# EAGLE schematic LSU 4.9 OpenAFR MainBoard (EAGLE 9.6.2)
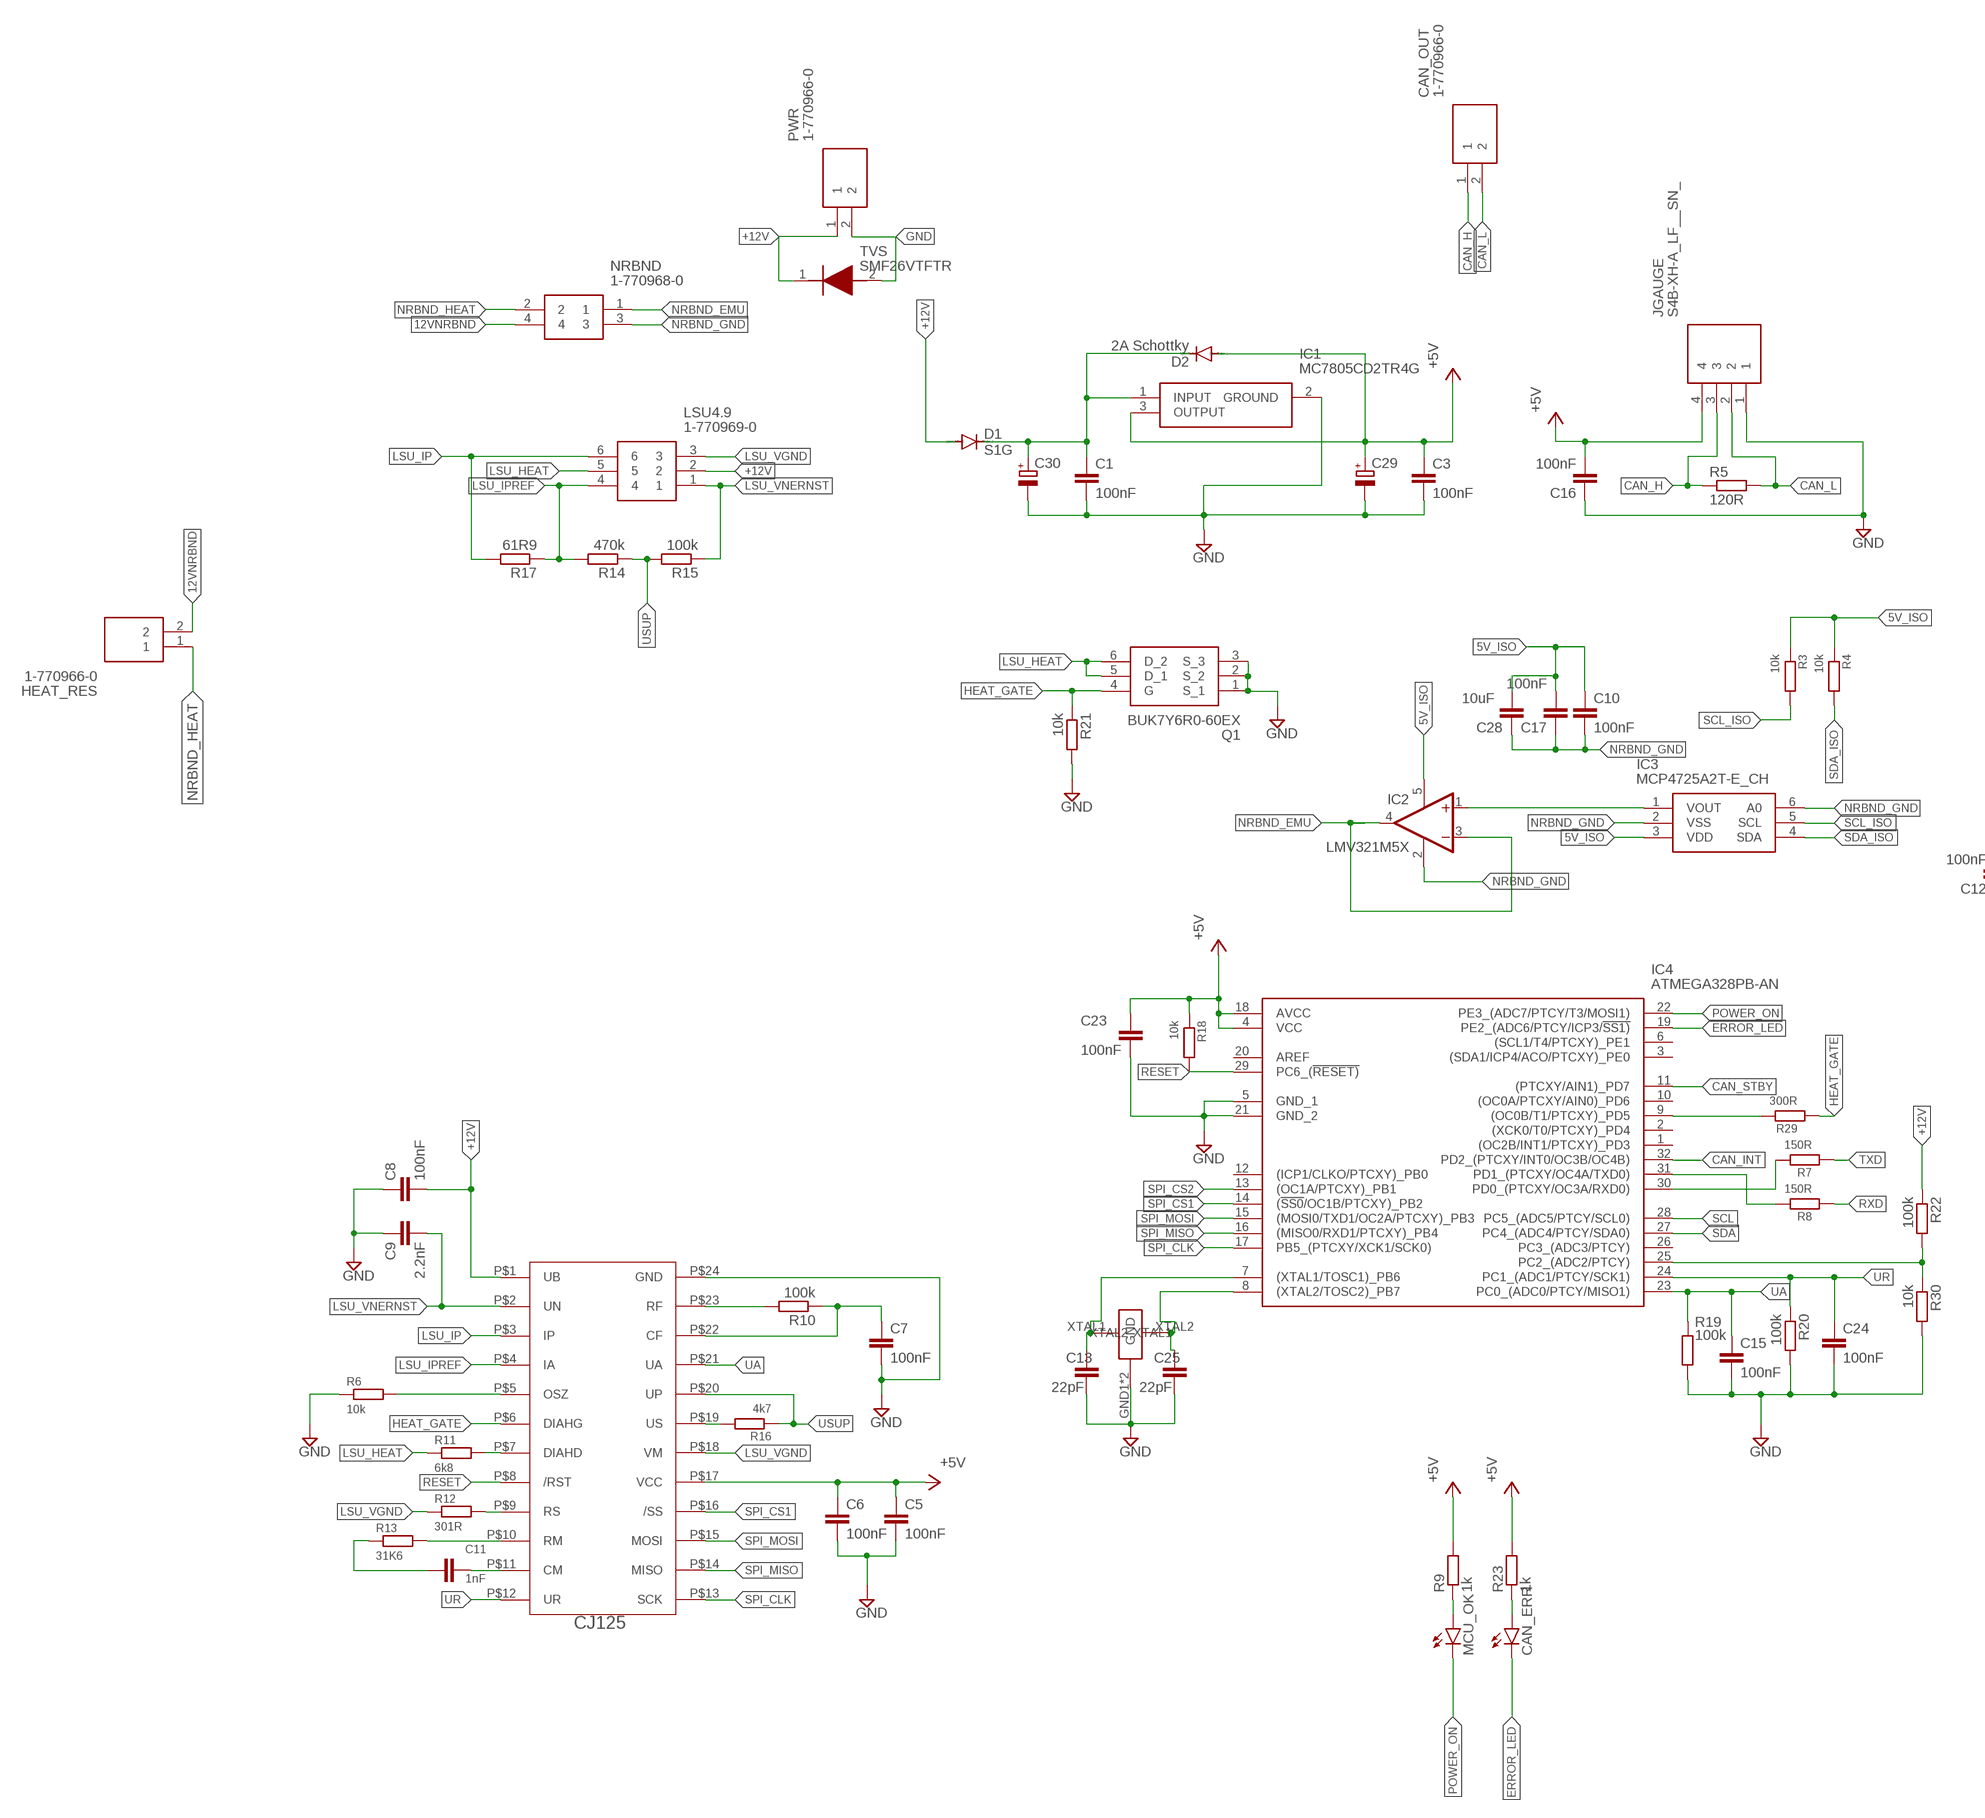
[diagram p0: schematic, sheet 1, part 1 of 2]
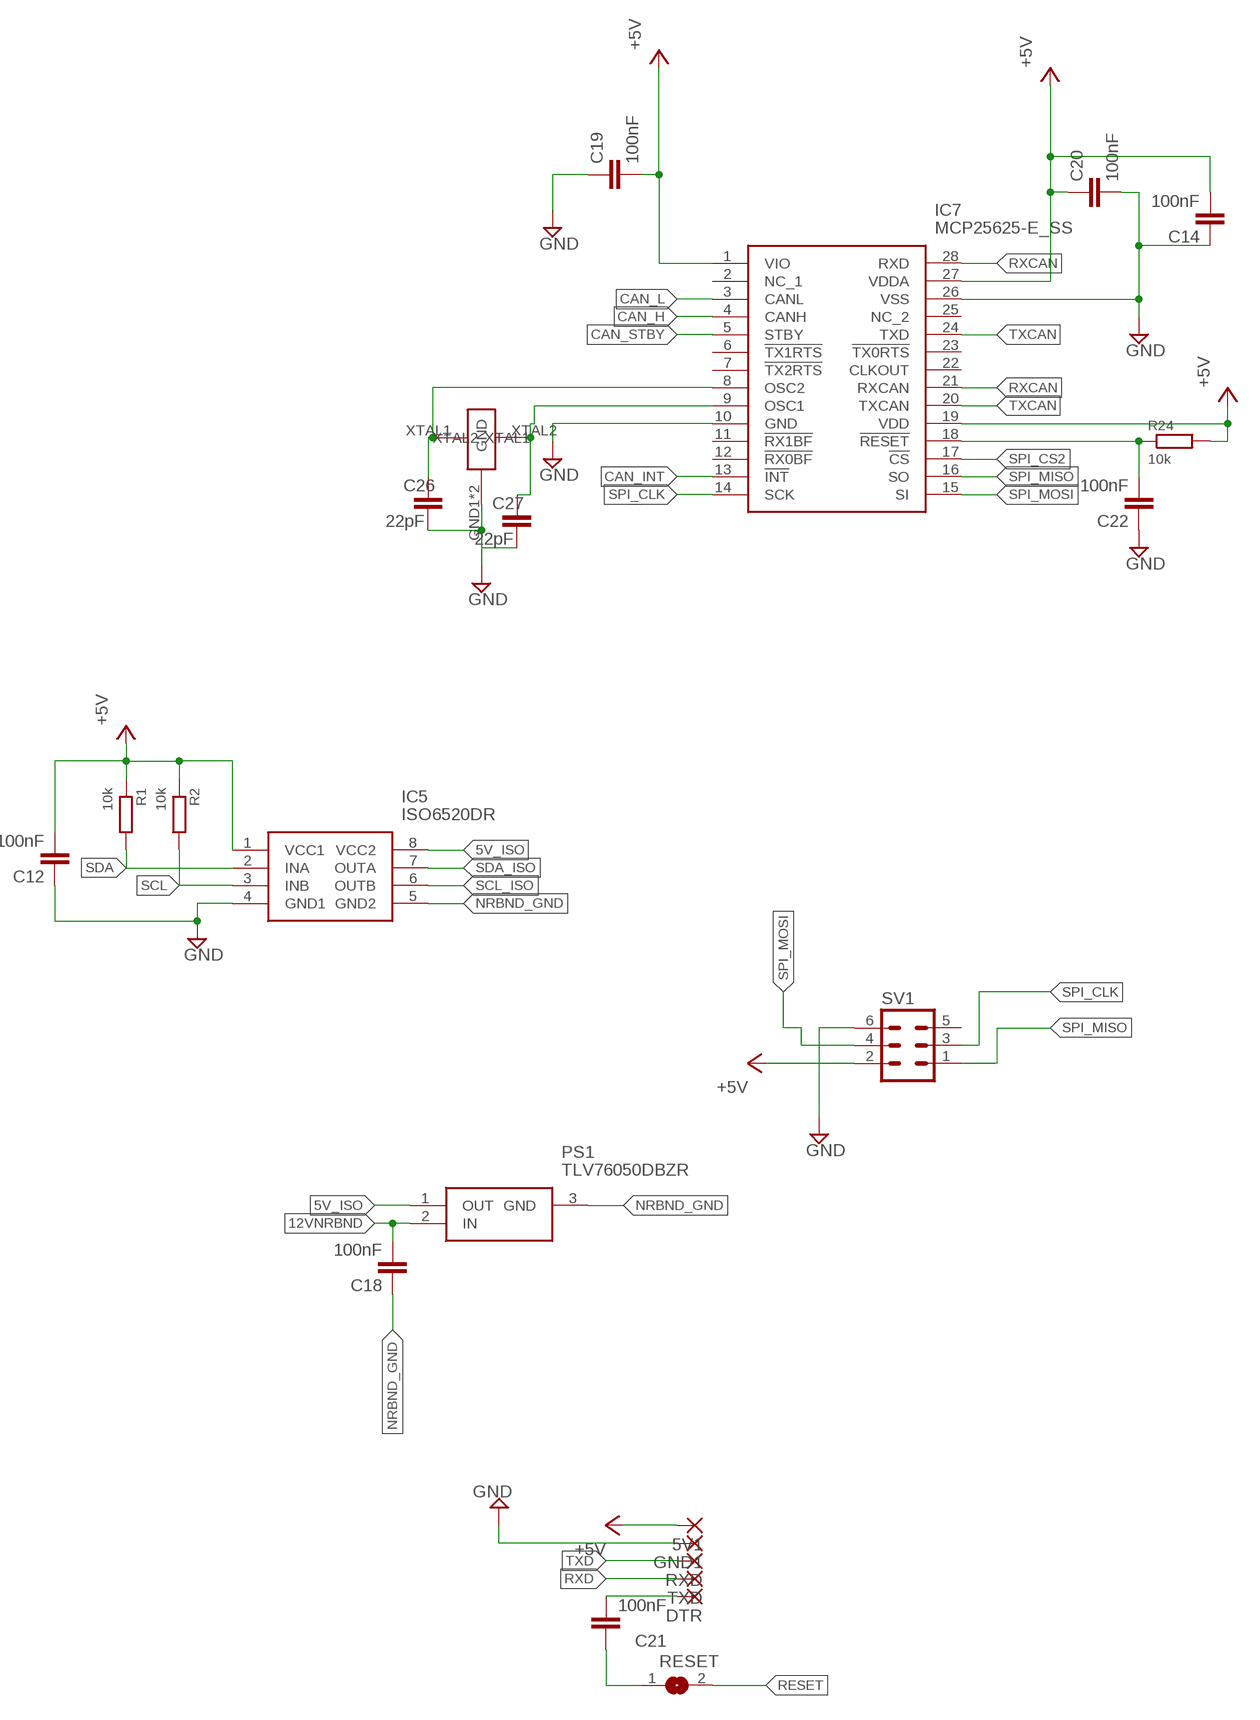
[diagram p1: schematic, sheet 1, part 2 of 2]

## Parts
5V1  1,6/0,9  [1,6/0,9]
C1  100nF  C-EUC0805  [C0805]
C3  100nF  C-EUC0805  [C0805]
C5  100nF  C-EUC0805  [C0805]
C6  100nF  C-EUC0805  [C0805]
C7  100nF  C-EUC0805  [C0805]
C8  100nF  C-EUC0805  [C0805]
C9  2.2nF  C-EUC0805  [C0805]
C10  100nF  C-EUC0805  [C0805]
C11  1nF  C-EUC0805  [C0805]
C12  100nF  C-EUC0805  [C0805]
C13  22pF  C-EUC0805  [C0805]
C14  100nF  C-EUC0805  [C0805]
C15  100nF  C-EUC0805  [C0805]
C16  100nF  C-EUC0805  [C0805]
C17  100nF  C-EUC0805  [C0805]
C18  100nF  C-EUC0805  [C0805]
C19  100nF  C-EUC0805  [C0805]
C20  100nF  C-EUC0805  [C0805]
C21  100nF  C-EUC0805  [C0805]
C22  100nF  C-EUC0805  [C0805]
C23  100nF  C-EUC0805  [C0805]
C24  100nF  C-EUC0805  [C0805]
C25  22pF  C-EUC0805  [C0805]
C26  22pF  C-EUC0805  [C0805]
C27  22pF  C-EUC0805  [C0805]
C28  10uF  C-EUC0805  [C0805]
C29  CPOL-EU153CLV-0605  [153CLV-0605]
C30  CPOL-EU153CLV-0605  [153CLV-0605]
CAN_ERR  LEDCHIPLED_1206  [CHIPLED_1206]
CAN_OUT  1-770966-0  [17709660]
D1  S1G  DIODE-DO-214AC  [DO-214AC]
D2  2A Schottky  DIODE-DO-214AC  [DO-214AC]
DTR  1,6/0,9  [1,6/0,9]
GND1  1,6/0,9  [1,6/0,9]
HEAT_RES  1-770966-0  [17709660]
IC1  MC7805CD2TR4G  [MC7805CD2TR4G]
IC2  LMV321M5X  [SOT23-5]
IC3  MCP4725A2T-E_CH  [SOT95P270X145-6N]
IC4  ATMEGA328PB-AN  [QFP80P900X900X120-32N]
IC5  ISO6520DR  [SOIC127P600X175-8N]
IC7  MCP25625-E_SS  [SOP65P780X200-28N]
JGAUGE  S4B-XH-A_LF__SN_  [S4BXHALFSN]
LSU4.9  1-770969-0  [17709690]
MCU_OK  LEDCHIPLED_1206  [CHIPLED_1206]
NRBND  1-770968-0  [17709680]
PS1  TLV76050DBZR  [SOT95P237X112-3N]
PWR  1-770966-0  [17709660]
Q1  BUK7Y6R0-60EX  [BUK7Y6R060EX]
R1  10k  R-EU_R0805  [R0805]
R2  10k  R-EU_R0805  [R0805]
R3  10k  R-EU_R0805  [R0805]
R4  10k  R-EU_R0805  [R0805]
R5  120R  R-EU_R1206  [R1206]
R6  10k  R-EU_R0805  [R0805]
R7  150R  R-EU_R0805  [R0805]
R8  150R  R-EU_R0805  [R0805]
R9  1k  R-EU_R0805  [R0805]
R10  100k  R-EU_R0805  [R0805]
R11  6k8  R-EU_R0805  [R0805]
R12  301R  R-EU_R0805  [R0805]
R13  31K6  R-EU_R0805  [R0805]
R14  470k  R-EU_R0805  [R0805]
R15  100k  R-EU_R0805  [R0805]
R16  4k7  R-EU_R0805  [R0805]
R17  61R9  R-EU_R0805  [R0805]
R18  10k  R-EU_R0805  [R0805]
R19  100k  R-EU_R0805  [R0805]
R20  100k  R-EU_R0805  [R0805]
R21  10k  R-EU_R0805  [R0805]
R22  100k  R-EU_R0805  [R0805]
R23  1k  R-EU_R0805  [R0805]
R24  10k  R-EU_R0805  [R0805]
R29  300R  R-EU_R0805  [R0805]
R30  10k  R-EU_R0805  [R0805]
RESET  SJ  [SJ]
RXD  1,6/0,9  [1,6/0,9]
SV1  MA03-2  [MA03-2]
TVS  SMF26VTFTR  [SMF26VTFTR]
TXD  1,6/0,9  [1,6/0,9]
U$1  CJ125-SOIC24  [CJ125-SOIC24]
U$4  E3X160181X04  [E3X160181X04]
U$5  E3X160181X04  [E3X160181X04]

## Nets
5V_ISO: C10.1 C17.2 C28.1 IC2.5(V+) IC3.3(VDD) IC5.8(VCC2) PS1.1(OUT) R3.1 R4.1
12VNRBND: C18.2 HEAT_RES.2 NRBND.4 PS1.2(IN)
+5V: 5V1.1(P) C3.1 C5.1 C6.1 C12.2 C14.2 C16.2 C19.2 C20.1 C23.1 C29.+ D2.A IC1.3(OUTPUT) IC4.4(VCC) IC4.18(AVCC) IC5.1(VCC1) IC7.1(VIO) IC7.19(VDD) IC7.27(VDDA) JGAUGE.4 R1.1 R2.1 R9.2 R18.1 R23.2 R24.2 SV1.2 U$1.P$17(VCC)
+12V: C8.2 D1.A LSU4.9.2 PWR.1 R22.1 TVS.1(K) U$1.P$1(UB)
CAN_H: CAN_OUT.1 IC7.4(CANH) JGAUGE.3 R5.1
CAN_INT: IC4.32(PD2_(PTCXY/INT0/OC3B/OC4B)) IC7.13(!INT)
CAN_L: CAN_OUT.2 IC7.3(CANL) JGAUGE.2 R5.2
CAN_STBY: IC4.11((PTCXY/AIN1)_PD7) IC7.5(STBY)
DTR: C21.2 DTR.1(P)
ERROR_LED: CAN_ERR.C IC4.19(PE2_(ADC6/PTCY/ICP3/!SS1))
GND: C1.2 C3.2 C5.2 C6.2 C7.2 C8.1 C9.2 C12.1 C13.2 C14.1 C15.2 C16.1 C19.1 C20.2 C22.1 C23.2 C24.2 C25.2 C26.2 C27.2 C29.- C30.- GND1.1(P) IC1.2(GROUND) IC4.5(GND_1) IC4.21(GND_2) IC5.4(GND1) IC7.10(GND) IC7.26(VSS) JGAUGE.1 PWR.2 Q1.1(S_1) Q1.2(S_2) Q1.3(S_3) R6.1 R19.2 R20.2 R21.2 R30.2 SV1.6 TVS.2(A) U$1.P$24(GND) U$4.GND1(GND) U$4.GND2(GND) U$5.GND1(GND) U$5.GND2(GND)
HEAT_GATE: Q1.4(G) R21.1 R29.1 U$1.P$6(DIAHG)
LSU_HEAT: LSU4.9.5 Q1.5(D_1) Q1.6(D_2) R11.1
LSU_IP: LSU4.9.6 R17.2 U$1.P$3(IP)
LSU_IPREF: LSU4.9.4 R14.2 R17.1 U$1.P$4(IA)
LSU_VGND: LSU4.9.3 R12.1 U$1.P$18(VM)
LSU_VNERNST: C9.1 LSU4.9.1 R15.1 U$1.P$2(UN)
N$1: C27.1 IC7.9(OSC1) U$5.XTAL2
N$2: R10.2 U$1.P$23(RF)
N$3: IC2.1(+IN) IC3.1(VOUT)
N$4: C21.1 RESET.1
N$5: C26.1 IC7.8(OSC2) U$5.XTAL1
N$6: C1.1 C30.+ D1.C D2.C IC1.1(INPUT)
N$7: R6.2 U$1.P$5(OSZ)
N$8: IC4.31(PD1_(PTCXY/OC4A/TXD0)) R8.2
N$9: IC4.30(PD0_(PTCXY/OC3A/RXD0)) R7.2
N$10: MCU_OK.A R9.1
N$11: C7.1 R10.1 U$1.P$22(CF)
N$12: CAN_ERR.A R23.1
N$13: C22.2 IC7.18(!RESET) R24.1
N$14: R12.2 U$1.P$9(RS)
N$15: R11.2 U$1.P$7(DIAHD)
N$16: R13.2 U$1.P$10(RM)
N$17: C11.1 R13.1
N$18: C11.2 U$1.P$11(CM)
N$20: R16.2 U$1.P$19(US)
N$23: IC4.25(PC2_(ADC2/PTCY)) R22.2 R30.1
N$24: C25.1 IC4.8((XTAL2/TOSC2)_PB7) U$4.XTAL2
N$25: C13.1 IC4.7((XTAL1/TOSC1)_PB6) U$4.XTAL1
N$32: IC4.9((OC0B/T1/PTCXY)_PD5) R29.2
NRBND_EMU: IC2.3(-IN) IC2.4(OUT) NRBND.1
NRBND_GND: C10.2 C17.1 C18.1 C28.2 IC2.2(V-) IC3.2(VSS) IC3.6(A0) IC5.5(GND2) NRBND.3 PS1.3(GND)
NRBND_HEAT: HEAT_RES.1 NRBND.2
POWER_ON: IC4.22(PE3_(ADC7/PTCY/T3/MOSI1)) MCU_OK.C
RESET: IC4.29(PC6_(!RESET)) R18.2 RESET.2 U$1.P$8(/RST)
RXCAN: IC7.21(RXCAN) IC7.28(RXD)
RXD: R8.1 TXD.1(P)
SCL: IC4.28(PC5_(ADC5/PTCY/SCL0)) IC5.3(INB) R2.2
SCL_ISO: IC3.5(SCL) IC5.6(OUTB) R3.2
SDA: IC4.27(PC4_(ADC4/PTCY/SDA0)) IC5.2(INA) R1.2
SDA_ISO: IC3.4(SDA) IC5.7(OUTA) R4.2
SPI_CLK: IC4.17(PB5_(PTCXY/XCK1/SCK0)) IC7.14(SCK) SV1.3 U$1.P$13(SCK)
SPI_CS1: IC4.14((!SS0!/OC1B/PTCXY)_PB2) U$1.P$16(/SS)
SPI_CS2: IC4.13((OC1A/PTCXY)_PB1) IC7.17(!CS)
SPI_MISO: IC4.16((MISO0/RXD1/PTCXY)_PB4) IC7.16(SO) SV1.1 U$1.P$14(MISO)
SPI_MOSI: IC4.15((MOSI0/TXD1/OC2A/PTCXY)_PB3) IC7.15(SI) SV1.4 U$1.P$15(MOSI)
TXCAN: IC7.20(TXCAN) IC7.24(TXD)
TXD: R7.1 RXD.1(P)
UA: C15.1 IC4.23(PC0_(ADC0/PTCY/MISO1)) R19.1 U$1.P$21(UA)
UR: C24.1 IC4.24(PC1_(ADC1/PTCY/SCK1)) R20.1 U$1.P$12(UR)
USUP: R14.1 R15.2 R16.1 U$1.P$20(UP)
Unconnected: IC4.1((OC2B/INT1/PTCXY)_PD3) IC4.2((XCK0/T0/PTCXY)_PD4) IC4.3((SDA1/ICP4/ACO/PTCXY)_PE0) IC4.6((SCL1/T4/PTCXY)_PE1) IC4.10((OC0A/PTCXY/AIN0)_PD6) IC4.12((ICP1/CLKO/PTCXY)_PB0) IC4.20(AREF) IC4.26(PC3_(ADC3/PTCY)) IC7.2(NC_1) IC7.6(!TX1RTS) IC7.7(!TX2RTS) IC7.11(!RX1BF) IC7.12(!RX0BF) IC7.22(CLKOUT) IC7.23(!TX0RTS) IC7.25(NC_2) SV1.5

## Library data of the parts
5V1 DTR GND1 RXD TXD = wirepad:1,6/0,9: THROUGH-HOLE PAD
C1 C3 C5-C28 = rcl:C-EU: CAPACITOR, European symbol; SPICEPREFIX: C
C29 C30 = rcl:CPOL-EU: POLARIZED CAPACITOR, European symbol; SPICEPREFIX: C
CAN_ERR MCU_OK = led:LED: LED OSRAM: - CHIPLED LG R971, LG N971, LY N971, LG Q971, LY Q971, LO R971, LY R971 LH N974, LH R974 LS Q976, LO Q976, LY Q976 LO Q996 - Hyper CHIPLED LW Q18S LB Q993, LB Q99A, LB R99A - SideLED LS A670, LO A670, LY A670, LG A670, LP A670 LB A673, LV A673, LT A673, LW A673 LH A674 LY A675 LS A676, LA A676, LO A676, LY A676, LW A676 LS A679, LY A679, LG A679 - Hyper Micro SIDELED® LS Y876, LA Y876, LO Y876, LY Y876 LT Y87S - SmartLED LW L88C, LW L88S LB L89C, LB L89S, LG L890 LS L89K, LO L89K, LY L89K LS L896, LA L896, LO L896, LY L896 - TOPLED LS T670, LO T670, LY T670, LG T670, LP T670 LSG T670, LSP T670, LSY T670, LOP T670, LYG T670 LG T671, LOG T671, LSG T671 LB T673, LV T673, LT T673, LW T673 LH T674 LS T676, LA T676, LO T676, LY T676, LB T676, LH T676, LSB T676, LW T676 LB T67C, LV T67C, LT T67C, LS T67K, LO T67K, LY T67K, LW E67C LS E67B, LA E67B, LO E67B, LY E67B, LB E67C, LV E67C, LT E67C LW T67C LS T679, LY T679, LG T679 LS T770, LO T770, LY T770, LG T770, LP T770 LB T773, LV T773, LT T773, LW T773 LH T774 LS E675, LA E675, LY E675, LS T675 LS T776, LA T776, LO T776, LY T776, LB T776 LHGB T686 LT T68C, LB T68C - Hyper Mini TOPLED® LB M676 - Mini TOPLED Santana® LG M470 LS M47K, LO M47K, LY M47K Source: http://www.osram.convergy.de LUXEON: - LUMILED® LXK2-PW12-R00, LXK2-PW12-S00, LXK2-PW14-U00, LXK2-PW14-V00 LXK2-PM12-R00, LXK2-PM12-S00, LXK2-PM14-U00 LXK2-PE12-Q00, LXK2-PE12-R00, LXK2-PE12-S00, LXK2-PE14-T00, LXK2-PE14-U00 LXK2-PB12-K00, LXK2-PB12-L00, LXK2-PB12-M00, LXK2-PB14-N00, LXK2-PB14-P00, LXK2-PB14-Q00 LXK2-PR12-L00, LXK2-PR12-M00, LXK2-PR14-Q00, LXK2-PR14-R00 LXK2-PD12-Q00, LXK2-PD12-R00, LXK2-PD12-S00 LXK2-PH12-R00, LXK2-PH12-S00 LXK2-PL12-P00, LXK2-PL12-Q00, LXK2-PL12-R00 Source: www.luxeon.com KINGBRIGHT: KA-3528ASYC Source: www.kingbright.com
CAN_OUT HEAT_RES PWR = 1-770966-0:1-770966-0: TE Connectivity MATE-N-LOK Series, 4.14mm Pitch 2 Way Right Angle Heavy Duty Power Connector, Solder Termination, 9.5A Source: Datasheet <https://www.te.com/commerce/DocumentDelivery/DDEController?Action=showdoc&DocId=Customer Drawing770966G1pdfEnglishENG_CD_770966_G1.pdf1-770966-0>; DESCRIPTION: TE Connectivity MATE-N-LOK Series, 4.14mm Pitch 2 Way Right Angle Heavy Duty Power Connector, Solder Termination, 9.5A; HEIGHT: 7.77mm; MANUFACTURER_NAME: TE Connectivity; MANUFACTURER_PART_NUMBER: 1-770966-0; MOUSER_PART_NUMBER: 571-1-770966-0; MOUSER_PRICE-STOCK: https://www.mouser.co.uk/ProductDetail/TE-Connectivity-AMP/1-770966-0?qs=qXO2HHLAcoJiZj6lD7oupQ%3D%3D
D1 D2 = diode:DIODE-: DIODE
IC1 = MC7805CD2TR4G:MC7805CD2TR4G: Linear Voltage Regulator IC Positive Fixed 1 Output 1A D2PAK-3 Source: Datasheet <https://www.onsemi.com/pdf/datasheet/mc7800-d.pdf>; DESCRIPTION: Linear Voltage Regulator IC Positive Fixed 1 Output 1A D2PAK-3; HEIGHT: 4.826mm; MANUFACTURER_NAME: onsemi; MANUFACTURER_PART_NUMBER: MC7805CD2TR4G; MOUSER_PART_NUMBER: 863-MC7805CD2TR4G; MOUSER_PRICE-STOCK: https://www.mouser.co.uk/ProductDetail/onsemi/MC7805CD2TR4G?qs=%252B9%2Fcbd0IE0TA2t8QN7DaSw%3D%3D
IC2 = linear:LMV321?*: General Purpose, Low Voltage, Rail-to-Rail Output Operational Amplifiers Source: http://www.national.com/mpf/LM/LMV321.html http://www.national.com/dt/lmv_qual.pdf
IC3 = MCP4725A2T-E_CH:MCP4725A2T-E_CH: Microchip MCP4725A2T-E/CH, 12 bit Serial DAC, 3.4Msps, 6-Pin SOT-23 Source: Datasheet <http://ww1.microchip.com/downloads/en/devicedoc/22039d.pdf>; DESCRIPTION: Microchip MCP4725A2T-E/CH, 12 bit Serial DAC, 3.4Msps, 6-Pin SOT-23; HEIGHT: 1.45mm; MANUFACTURER_NAME: Microchip; MANUFACTURER_PART_NUMBER: MCP4725A2T-E/CH; MOUSER_PART_NUMBER: 579-MCP4725A2T-E/CH; MOUSER_PRICE-STOCK: https://www.mouser.co.uk/ProductDetail/Microchip-Technology/MCP4725A2T-E-CH?qs=hH%252BOa0VZEiABOw9BMlFjfA%3D%3D
IC4 = ATMEGA328PB-AN:ATMEGA328PB-AN: MCU 8-bit ATmega AVR RISC 32KB Flash 2.5V/3.3V/5V 32-Pin TQFP Tray Source: Datasheet <http://ww1.microchip.com/downloads/en/DeviceDoc/40001906C.pdf>; DESCRIPTION: MCU 8-bit ATmega AVR RISC 32KB Flash 2.5V/3.3V/5V 32-Pin TQFP Tray; HEIGHT: 1.2mm; MANUFACTURER_NAME: Microchip; MANUFACTURER_PART_NUMBER: ATMEGA328PB-AN; MOUSER_PART_NUMBER: 556-ATMEGA328PB-AN; MOUSER_PRICE-STOCK: https://www.mouser.co.uk/ProductDetail/Microchip-Technology/ATMEGA328PB-AN?qs=jy4bLUHv09gDoS2J01KCIw%3D%3D
IC5 = ISO6520DR:ISO6520DR: Digital Isolators Functional isolation dual-channel 2/0 digital isolator Source: Datasheet <https://www.arrow.com/en/products/iso6520dr/texas-instruments?utm_currency=USD&region=nac>; DESCRIPTION: Digital Isolators Functional isolation dual-channel 2/0 digital isolator; HEIGHT: 1.75mm; MANUFACTURER_NAME: Texas Instruments; MANUFACTURER_PART_NUMBER: ISO6520DR; MOUSER_PART_NUMBER: 595-ISO6520DR; MOUSER_PRICE-STOCK: https://www.mouser.co.uk/ProductDetail/Texas-Instruments/ISO6520DR?qs=i8QVZAFTkqS9DQbJZwhOyw%3D%3D
IC7 = MCP25625-E_SS:MCP25625-E_SS: CAN Controller with Transceiver SSOP28 Microchip MCP25625-E/SS, CAN Controller 1MBps CAN 2.0, 28-Pin SSOP Source: Datasheet <https://datasheet.datasheetarchive.com/originals/distributors/Datasheets-DGA14/1192265.pdf>; DESCRIPTION: CAN Controller with Transceiver SSOP28 Microchip MCP25625-E/SS, CAN Controller 1MBps CAN 2.0, 28-Pin SSOP; HEIGHT: 2mm; MANUFACTURER_NAME: Microchip; MANUFACTURER_PART_NUMBER: MCP25625-E/SS; MOUSER_PART_NUMBER: 579-MCP25625-E/SS; MOUSER_PRICE-STOCK: https://www.mouser.co.uk/ProductDetail/Microchip-Technology/MCP25625-E-SS?qs=YlpJWyuQ3PO6FRVW%2Ffac7A%3D%3D
JGAUGE = S4B-XH-A_LF__SN_:S4B-XH-A_LF__SN_: XH-2.5mm Header side entry 4 way JST XH Series, Series Number S4B, 2.5mm Pitch 4 Way 1 Row Right Angle PCB Header, Solder Termination, 3A Source: Datasheet <https://www.mouser.co.uk/ProductDetail/JST-Commercial/S4B-XH-ALFSN?qs=QpmGXVUTftEyAvx%2Br33AyQ==&srsltid=AfmBOopXgwHK5vQKy207Eg2VBdixziHXVBrLkW0Mvqq_XGzuQb0VSmKc>; DESCRIPTION: XH-2.5mm Header side entry 4 way JST XH Series, Series Number S4B, 2.5mm Pitch 4 Way 1 Row Right Angle PCB Header, Solder Termination, 3A; HEIGHT: 7mm; MANUFACTURER_NAME: JST (JAPAN SOLDERLESS TERMINALS); MANUFACTURER_PART_NUMBER: S4B-XH-A(LF)(SN); MOUSER_PART_NUMBER: N/A; MOUSER_PRICE-STOCK: https://www.mouser.co.uk/ProductDetail/JST-Commercial/S4B-XH-ALFSN?qs=QpmGXVUTftF7eeJ4yg3VYQ%3D%3D
LSU4.9 = 1-770969-0:1-770969-0: PCB Mount Header, Right Angle, Wire-to-Board, 6 Position, 4.14 mm [.162 in] Centerline, Fully Shrouded, Tin, Mini-Universal MATE-N-LOK Source: Datasheet <https://www.te.com/commerce/DocumentDelivery/DDEController?Action=srchrtrv&DocNm=770969&DocType=Customer Drawing&DocLang=English&DocFormat=pdf&PartCntxt=1-770969-0>; DESCRIPTION: PCB Mount Header, Right Angle, Wire-to-Board, 6 Position, 4.14 mm [.162 in] Centerline, Fully Shrouded, Tin, Mini-Universal MATE-N-LOK; HEIGHT: 11.99mm; MANUFACTURER_NAME: TE Connectivity; MANUFACTURER_PART_NUMBER: 1-770969-0; MOUSER_PART_NUMBER: 571-1-770969-0; MOUSER_PRICE-STOCK: https://www.mouser.co.uk/ProductDetail/TE-Connectivity-AMP/1-770969-0?qs=qXO2HHLAcoJbD0GMLxxebg%3D%3D
NRBND = 1-770968-0:1-770968-0: PCB Mount Header, Right Angle, Wire-to-Board, 4 Position, 4.14 mm [.162 in] Centerline, Fully Shrouded, Tin, Mini-Universal MATE-N-LOK Source: Datasheet <http://www.te.com/commerce/DocumentDelivery/DDEController?Action=srchrtrv&DocNm=770968&DocType=Customer Drawing&DocLang=English&DocFormat=pdf&PartCntxt=1-770968-0>; DESCRIPTION: PCB Mount Header, Right Angle, Wire-to-Board, 4 Position, 4.14 mm [.162 in] Centerline, Fully Shrouded, Tin, Mini-Universal MATE-N-LOK; HEIGHT: 11.86mm; MANUFACTURER_NAME: TE Connectivity; MANUFACTURER_PART_NUMBER: 1-770968-0; MOUSER_PART_NUMBER: 571-1-770968-0; MOUSER_PRICE-STOCK: https://www.mouser.co.uk/ProductDetail/TE-Connectivity-AMP/1-770968-0?qs=qXO2HHLAcoL4Dw11VWHBrA%3D%3D
PS1 = TLV76050DBZR:TLV76050DBZR: 100-mA, 30-V wide-VIN, fixed-output linear voltage regulator Source: Datasheet <http://www.ti.com/lit/gpn/tlv760>; DESCRIPTION: 100-mA, 30-V wide-VIN, fixed-output linear voltage regulator; HEIGHT: 1.12mm; MANUFACTURER_NAME: Texas Instruments; MANUFACTURER_PART_NUMBER: TLV76050DBZR; MOUSER_PART_NUMBER: 595-TLV76050DBZR; MOUSER_PRICE-STOCK: https://www.mouser.co.uk/ProductDetail/Texas-Instruments/TLV76050DBZR?qs=HXFqYaX1Q2wum5FdXU6CLA%3D%3D
Q1 = BUK7Y6R0-60EX:BUK7Y6R0-60EX: MOSFET BUK7Y6R0-60E/SOT669/LFPAK Source: Datasheet <https://assets.nexperia.com/documents/data-sheet/BUK7Y6R0-60E.pdf>; DESCRIPTION: MOSFET BUK7Y6R0-60E/SOT669/LFPAK; HEIGHT: 1.2mm; MANUFACTURER_NAME: Nexperia; MANUFACTURER_PART_NUMBER: BUK7Y6R0-60EX; MOUSER_PART_NUMBER: 771-BUK7Y6R0-60EX; MOUSER_PRICE-STOCK: https://www.mouser.co.uk/ProductDetail/Nexperia/BUK7Y6R0-60EX?qs=cbprxTG2Yq9UL%2F2WHaKVPw%3D%3D
R1-R24 R29 R30 = rcl:R-EU_: RESISTOR, European symbol; SPICEPREFIX: R
RESET = jumper:SJ: SMD solder JUMPER
SV1 = con-lstb:MA03-2: PIN HEADER; OC_FARNELL: unknown; OC_NEWARK: unknown
TVS = SMF26VTFTR:SMF26VTFTR: Transient Voltage Suppressor (AEC-Q101 Qualified) Source: Datasheet <https://fscdn.rohm.com/en/products/databook/datasheet/discrete/diode/zener/smf26vtftr-e.pdf>; DESCRIPTION: Transient Voltage Suppressor (AEC-Q101 Qualified); HEIGHT: 0.9mm; MANUFACTURER_NAME: ROHM Semiconductor; MANUFACTURER_PART_NUMBER: SMF26VTFTR; MOUSER_PART_NUMBER: 755-SMF26VTFTR; MOUSER_PRICE-STOCK: https://www.mouser.co.uk/ProductDetail/ROHM-Semiconductor/SMF26VTFTR?qs=HXFqYaX1Q2zSWViY1YLSPg%3D%3D
U$1 = CJ125-SOIC24:CJ125-SOIC24
U$4 U$5 = E3X160181X04:E3X160181X04